# EAGLE schematic ekdps_v1 (EAGLE 9.6.2)
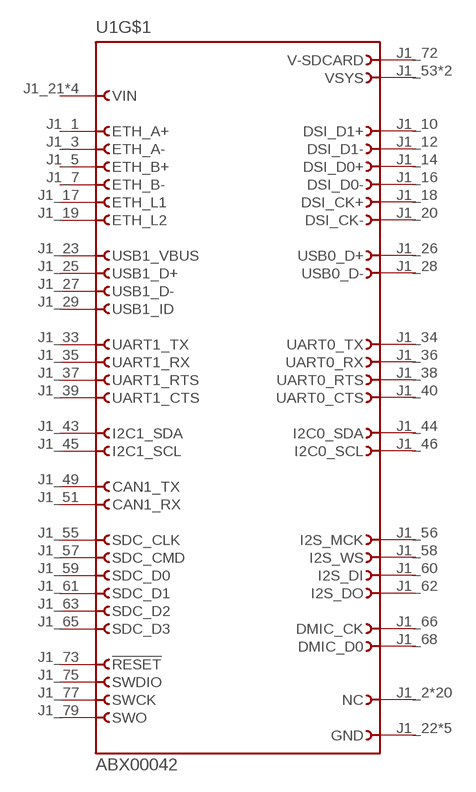
[diagram p0: schematic, sheet 1]

## Parts
U1  ABX00042  [MODULE_ABX00042]
Unconnected: U1.J1_1(ETH_A+) U1.J1_2(NC) U1.J1_3(ETH_A-) U1.J1_4(NC) U1.J1_5(ETH_B+) U1.J1_6(NC) U1.J1_7(ETH_B-) U1.J1_8(NC) U1.J1_9(NC) U1.J1_10(DSI_D1+) U1.J1_11(NC) U1.J1_12(DSI_D1-) U1.J1_13(NC) U1.J1_14(DSI_D0+) U1.J1_15(NC) U1.J1_16(DSI_D0-) U1.J1_17(ETH_L1) U1.J1_18(DSI_CK+) U1.J1_19(ETH_L2) U1.J1_20(DSI_CK-) U1.J1_21(VIN) U1.J1_24(NC) U1.J1_25(USB1_D+) U1.J1_26(USB0_D+) U1.J1_27(USB1_D-) U1.J1_28(USB0_D-) U1.J1_29(USB1_ID) U1.J1_30(NC) U1.J1_32(VIN) U1.J1_33(UART1_TX) U1.J1_34(UART0_TX) U1.J1_35(UART1_RX) U1.J1_36(UART0_RX) U1.J1_37(UART1_RTS) U1.J1_38(UART0_RTS) U1.J1_39(UART1_CTS) U1.J1_40(UART0_CTS) U1.J1_41(VIN) U1.J1_43(I2C1_SDA) U1.J1_44(I2C0_SDA) U1.J1_45(I2C1_SCL) U1.J1_46(I2C0_SCL) U1.J1_48(VIN) U1.J1_49(CAN1_TX) U1.J1_50(NC) U1.J1_51(CAN1_RX) U1.J1_52(NC) U1.J1_55(SDC_CLK) U1.J1_56(I2S_MCK) U1.J1_57(SDC_CMD) U1.J1_58(I2S_WS) U1.J1_59(SDC_D0) U1.J1_60(I2S_DI) U1.J1_61(SDC_D1) U1.J1_62(I2S_DO) U1.J1_63(SDC_D2) U1.J1_65(SDC_D3) U1.J1_66(DMIC_CK) U1.J1_67(NC) U1.J1_68(DMIC_D0) U1.J1_69(NC) U1.J1_70(NC) U1.J1_71(NC) U1.J1_73(!RESET) U1.J1_74(NC) U1.J1_75(SWDIO) U1.J1_76(NC) U1.J1_77(SWCK) U1.J1_78(NC) U1.J1_79(SWO) U1.J1_80(NC) U1.J2_1(FORCE_BOOTLOADER) U1.J2_2(CAM_D7) U1.J2_3(BOOT_SOURCE) U1.J2_4(CAM_D6) U1.J2_5(POWER_ON_REQ) U1.J2_6(CAM_D5) U1.J2_7(COINCELL) U1.J2_8(CAM_D4) U1.J2_9(NC_1) U1.J2_10(CAM_D3) U1.J2_11(NC_1) U1.J2_12(CAM_D2) U1.J2_13(NC_1) U1.J2_14(CAM_D1) U1.J2_15(NC_1) U1.J2_16(CAM_D0) U1.J2_17(NC_1) U1.J2_18(CAM_VS) U1.J2_19(NC_1) U1.J2_20(CAM_CLK) U1.J2_21(NC_1) U1.J2_22(CAM_HS) U1.J2_25(UART3_TX) U1.J2_26(UART2_TX) U1.J2_27(UART3_RX) U1.J2_28(UART2_RX) U1.J2_29(NC_1) U1.J2_30(NC_1) U1.J2_31(NC_1) U1.J2_32(NC_1) U1.J2_35(NC_1) U1.J2_36(SPI1_CS) U1.J2_37(NC_1) U1.J2_38(SPI1_CK) U1.J2_39(NC_1) U1.J2_40(SPI1_MISO) U1.J2_41(NC_1) U1.J2_42(SPI1_MOSI) U1.J2_45(I2C2_SDA) U1.J2_46(GPIO_0) U1.J2_47(I2C2_SCL) U1.J2_48(GPIO_1) U1.J2_49(SAI_CK) U1.J2_50(GPIO_2) U1.J2_51(SAI_FS) U1.J2_52(GPIO_3) U1.J2_53(SAI_D0) U1.J2_54(GPIO_4) U1.J2_55(NC_1) U1.J2_56(GPIO_5) U1.J2_58(GPIO_6) U1.J2_59(PWM_1) U1.J2_60(PWM_6) U1.J2_61(PWM_2) U1.J2_62(PWM_7) U1.J2_63(PWM_3) U1.J2_64(PWM_8) U1.J2_65(PWM_4) U1.J2_66(PWM_9) U1.J2_67(PWM_5) U1.J2_68(PWM_10) U1.J2_71(ADC_VREF+) U1.J2_72(ADC_VREF-) U1.J2_73(ADC_A0) U1.J2_74(ADC_A4) U1.J2_75(ADC_A1) U1.J2_76(ADC_A5) U1.J2_77(ADC_A2) U1.J2_78(ADC_A6) U1.J2_79(ADC_A3) U1.J2_80(ADC_A7)

## Power pins joined to a net without a drawn wire
GND: U1.J1_22(GND) U1.J1_31(GND) U1.J1_42(GND) U1.J1_47(GND) U1.J1_54(GND)
GND_1: U1.J2_24(GND_1) U1.J2_33(GND_1) U1.J2_44(GND_1) U1.J2_57(GND_1) U1.J2_70(GND_1)
USB1_VBUS: U1.J1_23(USB1_VBUS)
V-SDCARD: U1.J1_72(V-SDCARD)
VCC: U1.J2_34(VCC)
VCC/+3V3: U1.J2_23(VCC/+3V3) U1.J2_43(VCC/+3V3) U1.J2_69(VCC/+3V3)
VSYS: U1.J1_53(VSYS) U1.J1_64(VSYS)

## Library data of the parts
U1 = ABX00042:ABX00042: STM32H747 Portenta H7 series ARM Cortex-M4, Cortex-M7 MCU 32-Bit Embedded Evaluation Board Check availability <https://pricing.snapeda.com/parts/ABX00042/Arduino/view-part?ref=eda>; AVAILABILITY: In Stock; CHECK_PRICES: https://www.snapeda.com/parts/ABX00042/Arduino/view-part/?ref=eda; DESCRIPTION: Development Boards & Kits - ARM Portenta H7 | Arduino ABX00042; MF: Arduino; MP: ABX00042; PACKAGE: None; PRICE: None; PURCHASE-URL: https://www.snapeda.com/api/url_track_click_mouser/?unipart_id=6801596&manufacturer=Arduino&part_name=ABX00042&search_term=None; SNAPEDA_LINK: https://www.snapeda.com/parts/ABX00042/Arduino/view-part/?ref=snap